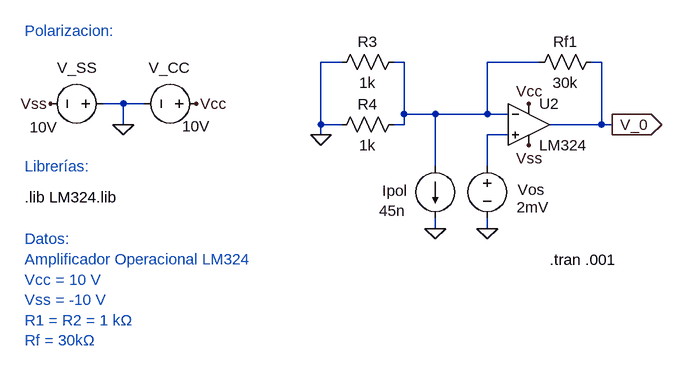
[diagram p0: schematic Lab_2_Circ_1_Ri=50+ErrorCC.asc]
Lab_2_Circ_1_Ri=50+ErrorCC.asc, the LTspice schematic file:
Version 4
SHEET 1 3400 964
WIRE 512 -256 480 -256
WIRE 608 -256 592 -256
WIRE 816 -256 736 -256
WIRE 912 -256 896 -256
WIRE 176 -192 144 -192
WIRE 208 -192 176 -192
WIRE 608 -176 608 -256
WIRE 656 -176 608 -176
WIRE 736 -176 736 -256
WIRE 736 -176 656 -176
WIRE 768 -176 736 -176
WIRE 176 -160 176 -192
WIRE 480 -160 480 -256
WIRE 512 -160 480 -160
WIRE 608 -160 608 -176
WIRE 608 -160 592 -160
WIRE 912 -160 912 -256
WIRE 912 -160 832 -160
WIRE 928 -160 912 -160
WIRE 480 -144 480 -160
WIRE 768 -144 736 -144
WIRE 656 -96 656 -176
WIRE 736 -96 736 -144
WIRE 656 0 656 -16
WIRE 736 0 736 -16
FLAG 288 -192 Vcc
FLAG 64 -192 Vss
FLAG 176 -160 0
FLAG 736 0 0
FLAG 800 -192 Vcc
FLAG 800 -128 Vss
FLAG 928 -160 V_0
IOPIN 928 -160 Out
FLAG 480 -144 0
FLAG 656 0 0
SYMBOL voltage 304 -192 R90
WINDOW 0 -55 25 VRight 2
WINDOW 3 35 -5 VRight 2
WINDOW 123 0 0 Left 0
WINDOW 39 0 0 Left 0
SYMATTR InstName V_CC
SYMATTR Value 10V
SYMBOL voltage 160 -192 R90
WINDOW 0 -55 25 VRight 2
WINDOW 3 36 85 VRight 2
WINDOW 123 0 0 Left 0
WINDOW 39 0 0 Left 0
SYMATTR InstName V_SS
SYMATTR Value 10V
SYMBOL OpAmps\\opamp2 800 -224 R0
SYMATTR InstName U2
SYMATTR Value LM324
SYMBOL res 496 -240 R270
WINDOW 0 32 56 VTop 2
WINDOW 3 0 56 VBottom 2
SYMATTR InstName R3
SYMATTR Value 1k
SYMBOL res 496 -144 R270
WINDOW 0 32 56 VTop 2
WINDOW 3 0 56 VBottom 2
SYMATTR InstName R4
SYMATTR Value 1k
SYMBOL res 912 -272 R90
WINDOW 0 0 56 VBottom 2
WINDOW 3 32 56 VTop 2
SYMATTR InstName Rf1
SYMATTR Value 30k
SYMBOL voltage 736 -112 M0
WINDOW 0 -47 52 Right 2
WINDOW 3 -45 79 Right 2
WINDOW 123 0 0 Left 0
WINDOW 39 0 0 Left 0
SYMATTR InstName Vos
SYMATTR Value 2mV
SYMBOL current 656 -96 M0
WINDOW 0 43 38 Left 2
WINDOW 3 46 69 Left 2
WINDOW 123 0 0 Left 0
WINDOW 39 0 0 Left 0
SYMATTR InstName Ipol
SYMATTR Value 45n
TEXT 24 -48 Left 2 !.lib LM324.lib
TEXT 24 -96 Left 2 ;Librerías:
TEXT 24 -304 Left 2 ;Polarizacion:
TEXT 24 16 Left 2 ;Datos:\nAmplificador Operacional LM324\nVcc = 10 V\nVss = -10 V\nR1 = R2 = 1 kΩ\nRf = 30kΩ
TEXT 832 48 Left 2 !.tran .001

The netlist it stands for:
* Lab_2_Circ_1_Ri=50+ErrorCC.asc
V_CC Vcc 0 10V
V_SS 0 Vss 10V
XU2 N002 N001 Vcc Vss V_0 LM324  ; pins In+ In- V+ V- OUT
R3 0 N001 1k
R4 0 N001 1k
Rf1 V_0 N001 30k
Vos N002 0 2mV
Ipol N001 0 45n
.lib LM324.lib
* Librerías:
* Polarizacion:
* Datos:
* Amplificador Operacional LM324
* Vcc = 10 V
* Vss = -10 V
* R1 = R2 = 1 kΩ
* Rf = 30kΩ
.tran .001
.backanno
.end